# Altium project 2014_BeaconEye.PRJPCB
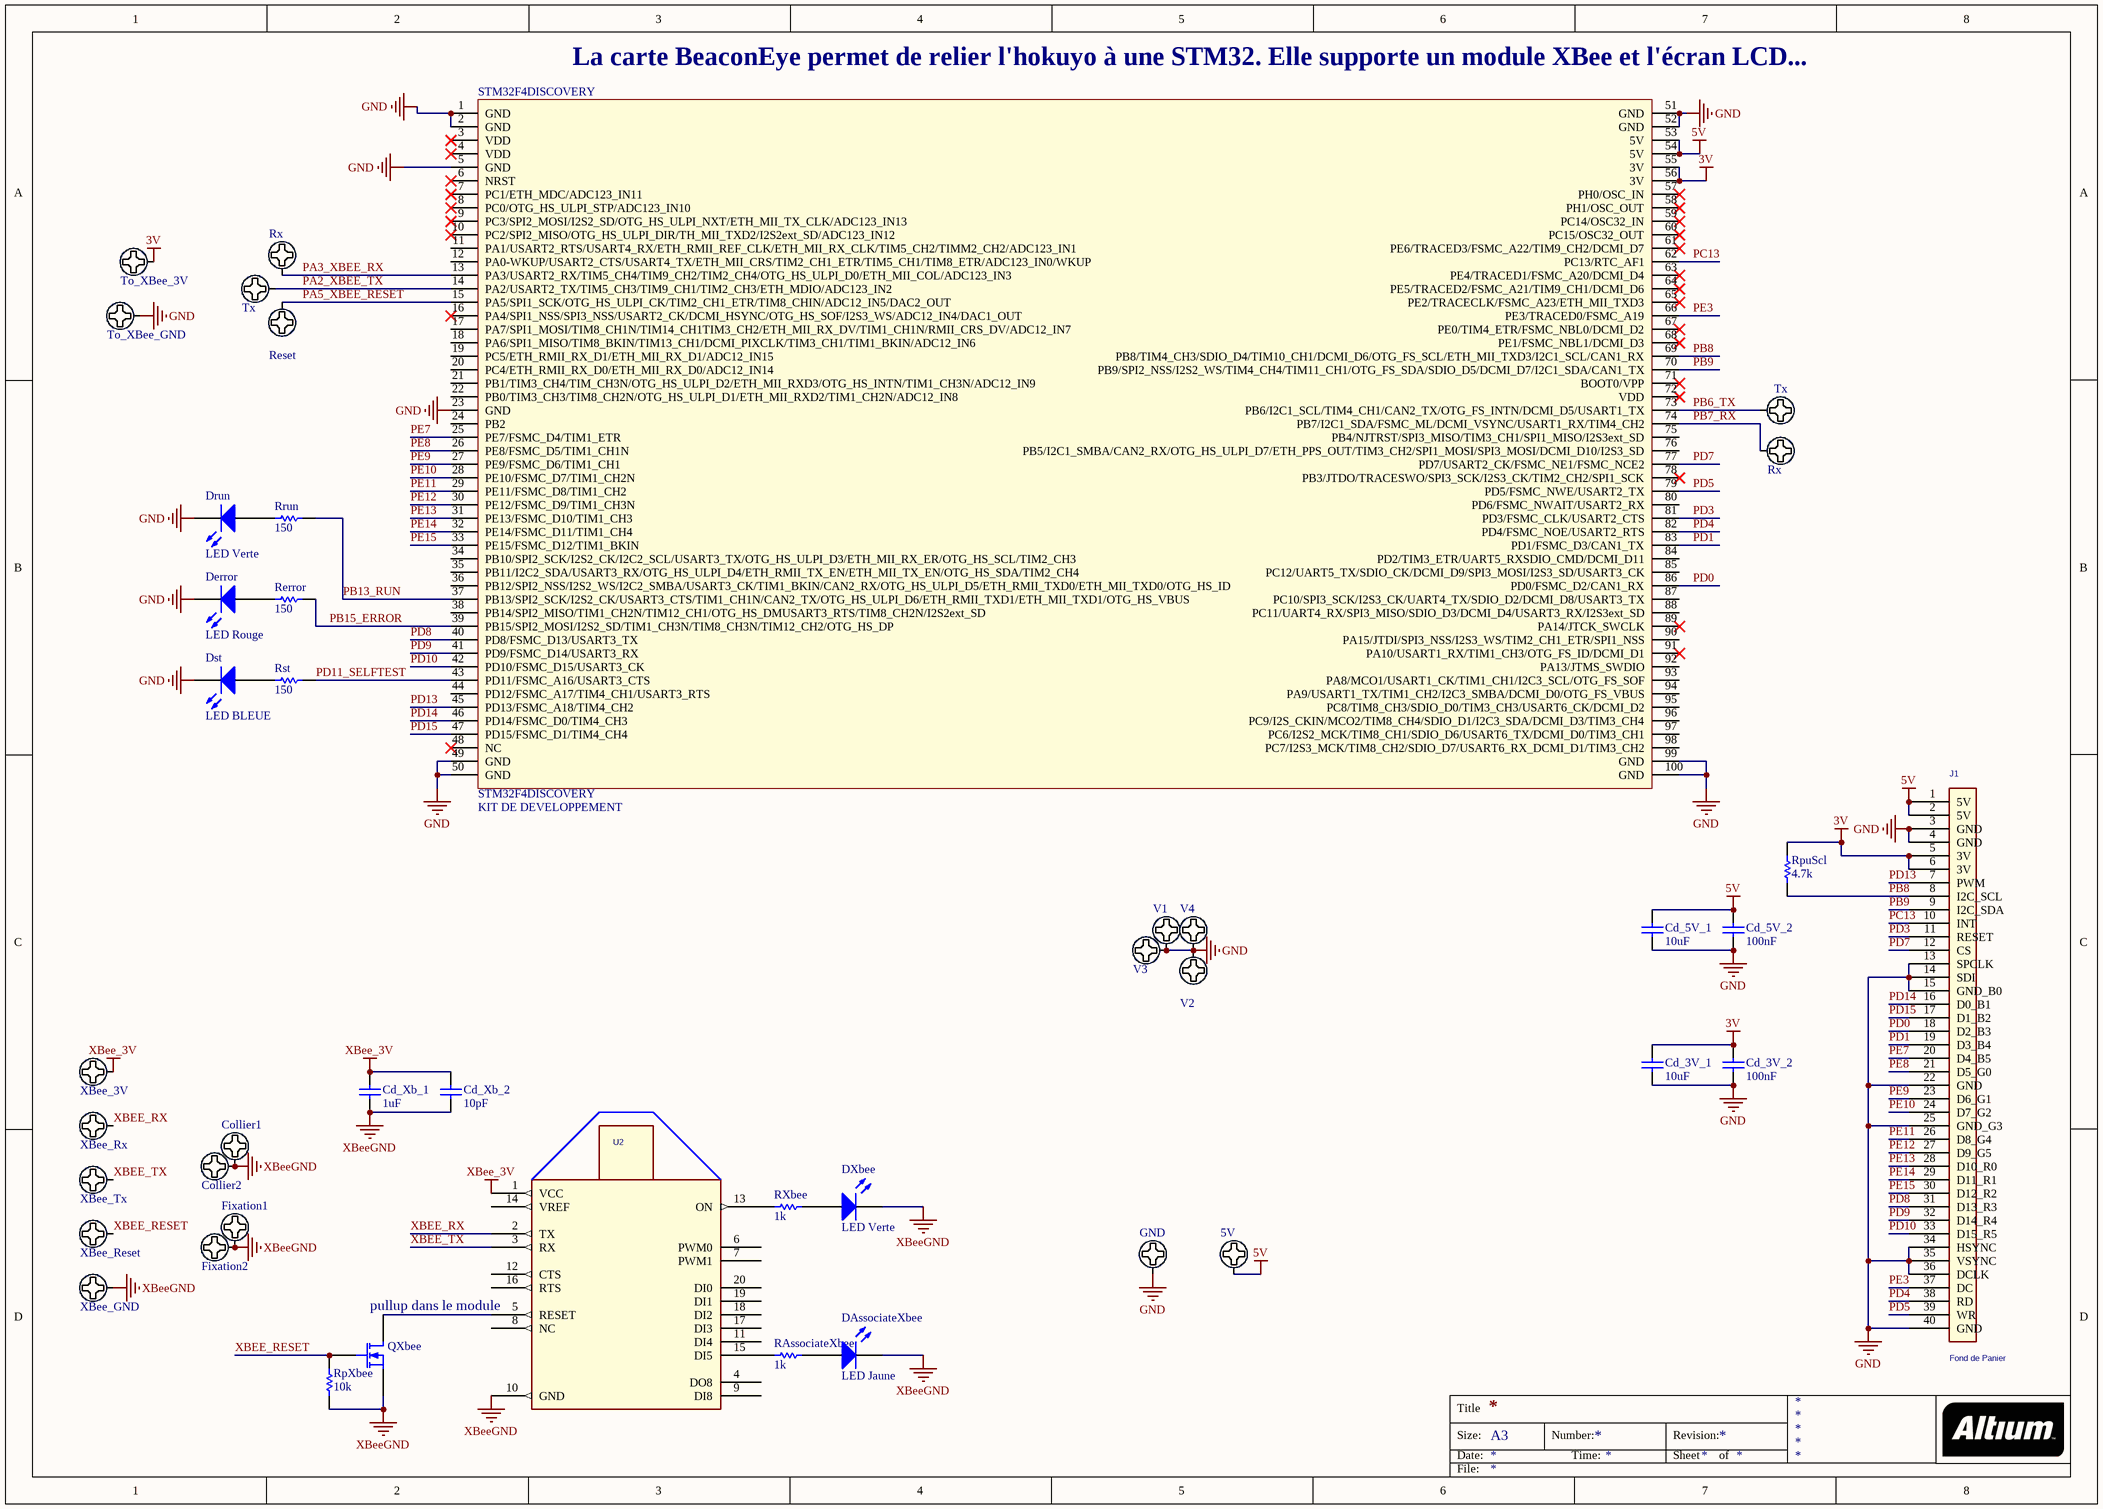
[diagram p0: 2014_BeaconEye.SchDoc]
1 sheet, 44 parts. Net scope: global (net labels, ports and power ports of the same name join across sheets).
Board file: 2014_BeaconEye.PCBDOC

## Sheet 2014_BeaconEye.SchDoc
size A3

### Parts
(Parts that share a designator on the sheet are numbered #1, #2 ... from top to bottom, then left to right.)
5V  Pad_M3  [PAD_CMS_5.08x2.54]  (value not drawn)
Cd_3V_1  10uF  [C1206_N]
Cd_3V_2  100nF  [C0805_N]
Cd_5V_1  10uF  [C1206_N]
Cd_5V_2  100nF  [C0805_N]
Cd_Xb_1  1uF  [C0805_N]
Cd_Xb_2  10pF  [C0805_N]
Collier1  Pad_M3  [M3x6mm]  (value not drawn)
Collier2  Pad_M3  [M3x6mm]  (value not drawn)
DAssociateXbee  LED Jaune  [LED_0805]
Derror  LED Rouge  [LED_0805]
Drun  LED Verte  [LED_0805]
Dst  LED BLEUE  [LED_0805]
DXbee  LED Verte  [LED_0805]
Fixation1  Pad_M3  [M3x6mm]  (value not drawn)
Fixation2  Pad_M3  [M3x6mm]  (value not drawn)
GND  Pad_M3  [PAD_CMS_5.08x2.54]  (value not drawn)
J1  Fond de Panier  [HE10/40_FACTO]
QXbee  Transistor MOSFET-N  [SOT23-3N]  (value not drawn)
RAssociateXbee  1k  [R1206_N]
Rerror  150  [R1206_N]
Reset  Pad_M3  [PAD_CMS_5.08x2.54]  (value not drawn)
RpuScl  4.7k  [R1206_N]
RpXbee  10k  [R1206_N]
Rrun  150  [R1206_N]
Rst  150  [R1206_N]
Rx#1  Pad_M3  [PAD_CMS_5.08x2.54]  (value not drawn)
Rx#2  Pad_M3  [PAD_CMS_5.08x2.54]  (value not drawn)
RXbee  1k  [R1206_N]
STM32F4DISCOVERY  STM32F4DISCOVERY  Type: KIT DE DEVELOPPEMENT  [STM32_F4DISCOVERY]
To_XBee_3V  Pad_M3  [PAD_CMS_5.08x2.54]  (value not drawn)
To_XBee_GND  Pad_M3  [PAD_CMS_5.08x2.54]  (value not drawn)
Tx#1  Pad_M3  [PAD_CMS_5.08x2.54]  (value not drawn)
Tx#2  Pad_M3  [PAD_CMS_5.08x2.54]  (value not drawn)
U2  XBee  [MODULE_XBEE]  (value not drawn)
V1  Pad_M3  [M3x6mm]  (value not drawn)
V2  Pad_M3  [M3x6mm]  (value not drawn)
V3  Pad_M3  [M3x6mm]  (value not drawn)
V4  Pad_M3  [M3x6mm]  (value not drawn)
XBee_3V  Pad_M3  [PAD_CMS_5.08x2.54]  (value not drawn)
XBee_GND  Pad_M3  [PAD_CMS_5.08x2.54]  (value not drawn)
XBee_Reset  Pad_M3  [PAD_CMS_5.08x2.54]  (value not drawn)
XBee_Rx  Pad_M3  [PAD_CMS_5.08x2.54]  (value not drawn)
XBee_Tx  Pad_M3  [PAD_CMS_5.08x2.54]  (value not drawn)

### Nets
3V: Cd_3V_1.2 Cd_3V_2.2 J1.5(3V) J1.6(3V) RpuScl.2 STM32F4DISCOVERY.55(3V) STM32F4DISCOVERY.56(3V) To_XBee_3V.1
5V: 5V.1 Cd_5V_1.2 Cd_5V_2.2 J1.1(5V) J1.2(5V) STM32F4DISCOVERY.53(5V) STM32F4DISCOVERY.54(5V)
GND: Cd_3V_1.1 Cd_3V_2.1 Cd_5V_1.1 Cd_5V_2.1 Derror.2(K) Drun.2(K) Dst.2(K) GND.1 J1.3(GND) J1.4(GND) J1.13(SPCLK) J1.14(SDI) J1.15(GND_B0) J1.22(GND) J1.25(GND_G3) J1.34(HSYNC) J1.35(VSYNC) J1.36(DCLK) J1.40(GND) STM32F4DISCOVERY.1(GND) STM32F4DISCOVERY.2(GND) STM32F4DISCOVERY.5(GND) STM32F4DISCOVERY.23(GND) STM32F4DISCOVERY.49(GND) STM32F4DISCOVERY.50(GND) STM32F4DISCOVERY.51(GND) STM32F4DISCOVERY.52(GND) STM32F4DISCOVERY.99(GND) STM32F4DISCOVERY.100(GND) To_XBee_GND.1 V1.1 V2.1 V3.1 V4.1
XBee_3V: Cd_Xb_1.2 Cd_Xb_2.2 U2.1(VCC) XBee_3V.1
XBeeGND: Cd_Xb_1.1 Cd_Xb_2.1 Collier1.1 Collier2.1 DAssociateXbee.2(K) DXbee.2(K) Fixation1.1 Fixation2.1 QXbee.2(S) RpXbee.2 U2.10(GND) XBee_GND.1
PA2_XBEE_TX: STM32F4DISCOVERY.14(PA2/USART2_TX/TIM5_CH3/TIM9_CH1/TIM2_CH3/ETH_MDIO/ADC123_IN2) Tx#1.1
PA3_XBEE_RX: Rx#1.1 STM32F4DISCOVERY.13(PA3/USART2_RX/TIM5_CH4/TIM9_CH2/TIM2_CH4/OTG_HS_ULPI_D0/ETH_MII_COL/ADC123_IN3)
PA5_XBEE_RESET: Reset.1 STM32F4DISCOVERY.15(PA5/SPI1_SCK/OTG_HS_ULPI_CK/TIM2_CH1_ETR/TIM8_CHIN/ADC12_IN5/DAC2_OUT)
PB6_TX: STM32F4DISCOVERY.73(PB6/I2C1_SCL/TIM4_CH1/CAN2_TX/OTG_FS_INTN/DCMI_D5/USART1_TX) Tx#2.1
PB7_RX: Rx#2.1 STM32F4DISCOVERY.74(PB7/I2C1_SDA/FSMC_ML/DCMI_VSYNC/USART1_RX/TIM4_CH2)
PB8: J1.8(I2C_SCL) RpuScl.1 STM32F4DISCOVERY.69(PB8/TIM4_CH3/SDIO_D4/TIM10_CH1/DCMI_D6/OTG_FS_SCL/ETH_MII_TXD3/I2C1_SCL/CAN1_RX)
PB9: J1.9(I2C_SDA) STM32F4DISCOVERY.70(PB9/SPI2_NSS/I2S2_WS/TIM4_CH4/TIM11_CH1/OTG_FS_SDA/SDIO_D5/DCMI_D7/I2C1_SDA/CAN1_TX)
PB13_RUN: Rrun.1 STM32F4DISCOVERY.37(PB13/SPI2_SCK/I2S2_CK/USART3_CTS/TIM1_CH1N/CAN2_TX/OTG_HS_ULPI_D6/ETH_RMII_TXD1/ETH_MII_TXD1/OTG_HS_VBUS)
PB15_ERROR: Rerror.1 STM32F4DISCOVERY.39(PB15/SPI2_MOSI/I2S2_SD/TIM1_CH3N/TIM8_CH3N/TIM12_CH2/OTG_HS_DP)
PC13: J1.10(INT) STM32F4DISCOVERY.62(PC13/RTC_AF1)
PD0: J1.18(D2_B3) STM32F4DISCOVERY.86(PD0/FSMC_D2/CAN1_RX)
PD1: J1.19(D3_B4) STM32F4DISCOVERY.83(PD1/FSMC_D3/CAN1_TX)
PD3: J1.11(RESET) STM32F4DISCOVERY.81(PD3/FSMC_CLK/USART2_CTS)
PD4: J1.38(RD) STM32F4DISCOVERY.82(PD4/FSMC_NOE/USART2_RTS)
PD5: J1.39(WR) STM32F4DISCOVERY.79(PD5/FSMC_NWE/USART2_TX)
PD7: J1.12(CS) STM32F4DISCOVERY.77(PD7/USART2_CK/FSMC_NE1/FSMC_NCE2)
PD8: J1.31(D13_R3) STM32F4DISCOVERY.40(PD8/FSMC_D13/USART3_TX)
PD9: J1.32(D14_R4) STM32F4DISCOVERY.41(PD9/FSMC_D14/USART3_RX)
PD10: J1.33(D15_R5) STM32F4DISCOVERY.42(PD10/FSMC_D15/USART3_CK)
PD11_SELFTEST: Rst.1 STM32F4DISCOVERY.43(PD11/FSMC_A16/USART3_CTS)
PD13: J1.7(PWM) STM32F4DISCOVERY.45(PD13/FSMC_A18/TIM4_CH2)
PD14: J1.16(D0_B1) STM32F4DISCOVERY.46(PD14/FSMC_D0/TIM4_CH3)
PD15: J1.17(D1_B2) STM32F4DISCOVERY.47(PD15/FSMC_D1/TIM4_CH4)
PE3: J1.37(DC) STM32F4DISCOVERY.66(PE3/TRACED0/FSMC_A19)
PE7: J1.20(D4_B5) STM32F4DISCOVERY.25(PE7/FSMC_D4/TIM1_ETR)
PE8: J1.21(D5_G0) STM32F4DISCOVERY.26(PE8/FSMC_D5/TIM1_CH1N)
PE9: J1.23(D6_G1) STM32F4DISCOVERY.27(PE9/FSMC_D6/TIM1_CH1)
PE10: J1.24(D7_G2) STM32F4DISCOVERY.28(PE10/FSMC_D7/TIM1_CH2N)
PE11: J1.26(D8_G4) STM32F4DISCOVERY.29(PE11/FSMC_D8/TIM1_CH2)
PE12: J1.27(D9_G5) STM32F4DISCOVERY.30(PE12/FSMC_D9/TIM1_CH3N)
PE13: J1.28(D10_R0) STM32F4DISCOVERY.31(PE13/FSMC_D10/TIM1_CH3)
PE14: J1.29(D11_R1) STM32F4DISCOVERY.32(PE14/FSMC_D11/TIM1_CH4)
PE15: J1.30(D12_R2) STM32F4DISCOVERY.33(PE15/FSMC_D12/TIM1_BKIN)
XBEE_RESET: QXbee.1(G) RpXbee.1 XBee_Reset.1
XBEE_RX: U2.2(TX) XBee_Rx.1
XBEE_TX: U2.3(RX) XBee_Tx.1
NetDAssociateXbee_1: DAssociateXbee.1(A) RAssociateXbee.2
NetDerror_1: Derror.1(A) Rerror.2
NetDrun_1: Drun.1(A) Rrun.2
NetDst_1: Dst.1(A) Rst.2
NetDXbee_1: DXbee.1(A) RXbee.2
NetQXbee_3: QXbee.3(D) U2.5(RESET)
NetRAssociateXbee_1: RAssociateXbee.1 U2.15(DI5)
NetRXbee_1: RXbee.1 U2.13(ON)

Not connected (* = marked no-connect by the designer): STM32F4DISCOVERY 3(VDD)* 4(VDD)* 6(NRST)* 7(PC1/ETH_MDC/ADC123_IN11)* 8(PC0/OTG_HS_ULPI_STP/ADC123_IN10)* 9(PC3/SPI2_MOSI/I2S2_SD/OTG_HS_ULPI_NXT/ETH_MII_TX_CLK/ADC123_IN13)* 10(PC2/SPI2_MISO/OTG_HS_ULPI_DIR/TH_MII_TXD2/I2S2ext_SD/ADC123_IN12)* 11(PA1/USART2_RTS/USART4_RX/ETH_RMII_REF_CLK/ETH_MII_RX_CLK/TIM5_CH2/TIMM2_CH2/ADC123_IN1) 12(PA0-WKUP/USART2_CTS/USART4_TX/ETH_MII_CRS/TIM2_CH1_ETR/TIM5_CH1/TIM8_ETR/ADC123_IN0/WKUP) 16(PA4/SPI1_NSS/SPI3_NSS/USART2_CK/DCMI_HSYNC/OTG_HS_SOF/I2S3_WS/ADC12_IN4/DAC1_OUT)* 17(PA7/SPI1_MOSI/TIM8_CH1N/TIM14_CH1TIM3_CH2/ETH_MII_RX_DV/TIM1_CH1N/RMII_CRS_DV/ADC12_IN7) 18(PA6/SPI1_MISO/TIM8_BKIN/TIM13_CH1/DCMI_PIXCLK/TIM3_CH1/TIM1_BKIN/ADC12_IN6) 19(PC5/ETH_RMII_RX_D1/ETH_MII_RX_D1/ADC12_IN15) 20(PC4/ETH_RMII_RX_D0/ETH_MII_RX_D0/ADC12_IN14) 21(PB1/TIM3_CH4/TIM_CH3N/OTG_HS_ULPI_D2/ETH_MII_RXD3/OTG_HS_INTN/TIM1_CH3N/ADC12_IN9) 22(PB0/TIM3_CH3/TIM8_CH2N/OTG_HS_ULPI_D1/ETH_MII_RXD2/TIM1_CH2N/ADC12_IN8) 24(PB2) 34(PB10/SPI2_SCK/I2S2_CK/I2C2_SCL/USART3_TX/OTG_HS_ULPI_D3/ETH_MII_RX_ER/OTG_HS_SCL/TIM2_CH3) 35(PB11/I2C2_SDA/USART3_RX/OTG_HS_ULPI_D4/ETH_RMII_TX_EN/ETH_MII_TX_EN/OTG_HS_SDA/TIM2_CH4) 36(PB12/SPI2_NSS/I2S2_WS/I2C2_SMBA/USART3_CK/TIM1_BKIN/CAN2_RX/OTG_HS_ULPI_D5/ETH_RMII_TXD0/ETH_MII_TXD0/OTG_HS_ID) 38(PB14/SPI2_MISO/TIM1_CH2N/TIM12_CH1/OTG_HS_DMUSART3_RTS/TIM8_CH2N/I2S2ext_SD) 44(PD12/FSMC_A17/TIM4_CH1/USART3_RTS) 48(NC)* 57(PH0/OSC_IN)* 58(PH1/OSC_OUT)* 59(PC14/OSC32_IN)* 60(PC15/OSC32_OUT)* 61(PE6/TRACED3/FSMC_A22/TIM9_CH2/DCMI_D7)* 63(PE4/TRACED1/FSMC_A20/DCMI_D4)* 64(PE5/TRACED2/FSMC_A21/TIM9_CH1/DCMI_D6)* 65(PE2/TRACECLK/FSMC_A23/ETH_MII_TXD3)* 67(PE0/TIM4_ETR/FSMC_NBL0/DCMI_D2)* 68(PE1/FSMC_NBL1/DCMI_D3)* 71(BOOT0/VPP)* 72(VDD)* 75(PB4/NJTRST/SPI3_MISO/TIM3_CH1/SPI1_MISO/I2S3ext_SD) 76(PB5/I2C1_SMBA/CAN2_RX/OTG_HS_ULPI_D7/ETH_PPS_OUT/TIM3_CH2/SPI1_MOSI/SPI3_MOSI/DCMI_D10/I2S3_SD) 78(PB3/JTDO/TRACESWO/SPI3_SCK/I2S3_CK/TIM2_CH2/SPI1_SCK)* 80(PD6/FSMC_NWAIT/USART2_RX) 84(PD2/TIM3_ETR/UART5_RXSDIO_CMD/DCMI_D11) 85(PC12/UART5_TX/SDIO_CK/DCMI_D9/SPI3_MOSI/I2S3_SD/USART3_CK) 87(PC10/SPI3_SCK/I2S3_CK/UART4_TX/SDIO_D2/DCMI_D8/USART3_TX) 88(PC11/UART4_RX/SPI3_MISO/SDIO_D3/DCMI_D4/USART3_RX/I2S3ext_SD) 89(PA14/JTCK_SWCLK)* 90(PA15/JTDI/SPI3_NSS/I2S3_WS/TIM2_CH1_ETR/SPI1_NSS) 91(PA10/USART1_RX/TIM1_CH3/OTG_FS_ID/DCMI_D1)* 92(PA13/JTMS_SWDIO) 93(PA8/MCO1/USART1_CK/TIM1_CH1/I2C3_SCL/OTG_FS_SOF) 94(PA9/USART1_TX/TIM1_CH2/I2C3_SMBA/DCMI_D0/OTG_FS_VBUS) 95(PC8/TIM8_CH3/SDIO_D0/TIM3_CH3/USART6_CK/DCMI_D2) 96(PC9/I2S_CKIN/MCO2/TIM8_CH4/SDIO_D1/I2C3_SDA/DCMI_D3/TIM3_CH4) 97(PC6/I2S2_MCK/TIM8_CH1/SDIO_D6/USART6_TX/DCMI_D0/TIM3_CH1) 98(PC7/I2S3_MCK/TIM8_CH2/SDIO_D7/USART6_RX_DCMI_D1/TIM3_CH2); U2 4(DO8) 6(PWM0) 7(PWM1) 8(NC) 9(DI8) 11(DI4) 12(CTS) 14(VREF) 16(RTS) 17(DI3) 18(DI2) 19(DI1) 20(DI0)

### Notes on the sheet
- (near STM32F4DISCOVERY) La carte BeaconEye permet de relier l'hokuyo à une STM32. Elle supporte un module XBee et l'écran LCD...
- (near U2) pullup dans le module
- Title
- Size:
- Date:
- A3
- Number:
- Time:
- Revision:
- Sheet
- of
- File:

### Library data of the parts
5V Collier1 Collier2 Fixation1 Fixation2 GND Reset Rx#1 Rx#2 To_XBee_3V To_XBee_GND Tx#1 Tx#2 V1-V4 XBee_3V XBee_GND XBee_Reset XBee_Rx XBee_Tx = Vis M3 X 6mm _TORX_Tête 6mm: Publisher: Damien Guitton
Cd_3V_1 Cd_3V_2 Cd_5V_1 Cd_5V_2 Cd_Xb_1 Cd_Xb_2 = Condensateur: Capacitor; Published: 8-Jun-2000; LatestRevisionDate: 17-Jul-2002; LatestRevisionNote: Re-released for DXP Platform.; PackageReference: RAD-0.3; Publisher: Altium Limited
DAssociateXbee Derror Drun Dst DXbee = LED: Typical LED; Published: 8-Jun-2000; LatestRevisionDate: 08-Jul-2005; LatestRevisionNote: Mech Layer 1 removed.; PackageReference: LED-1; Publisher: Altium Limited
J1 = CONNECTEUR_HE10_40
QXbee = Transistor MOSFET-N: N-Channel MOSFET; PackageDocument: 1995/1996; Published: 8-Jun-2000; LatestRevisionDate: 17-Jul-2002; LatestRevisionNote: Re-released for DXP Platform.; PackageReference: E3; Publisher: Altium Limited
RAssociateXbee Rerror RpuScl RpXbee Rrun Rst RXbee = Resistor: Published: 8-Jun-2000; LatestRevisionDate: 17-Jul-2002; LatestRevisionNote: Re-released for DXP Platform.; PackageReference: AXIAL-0.5; Publisher: Altium Limited
STM32F4DISCOVERY = STM32F4DISCOVERY: KIT DE DEVELOPPEMENT POUR MICROCONTROLEUR STM32F407VGT6